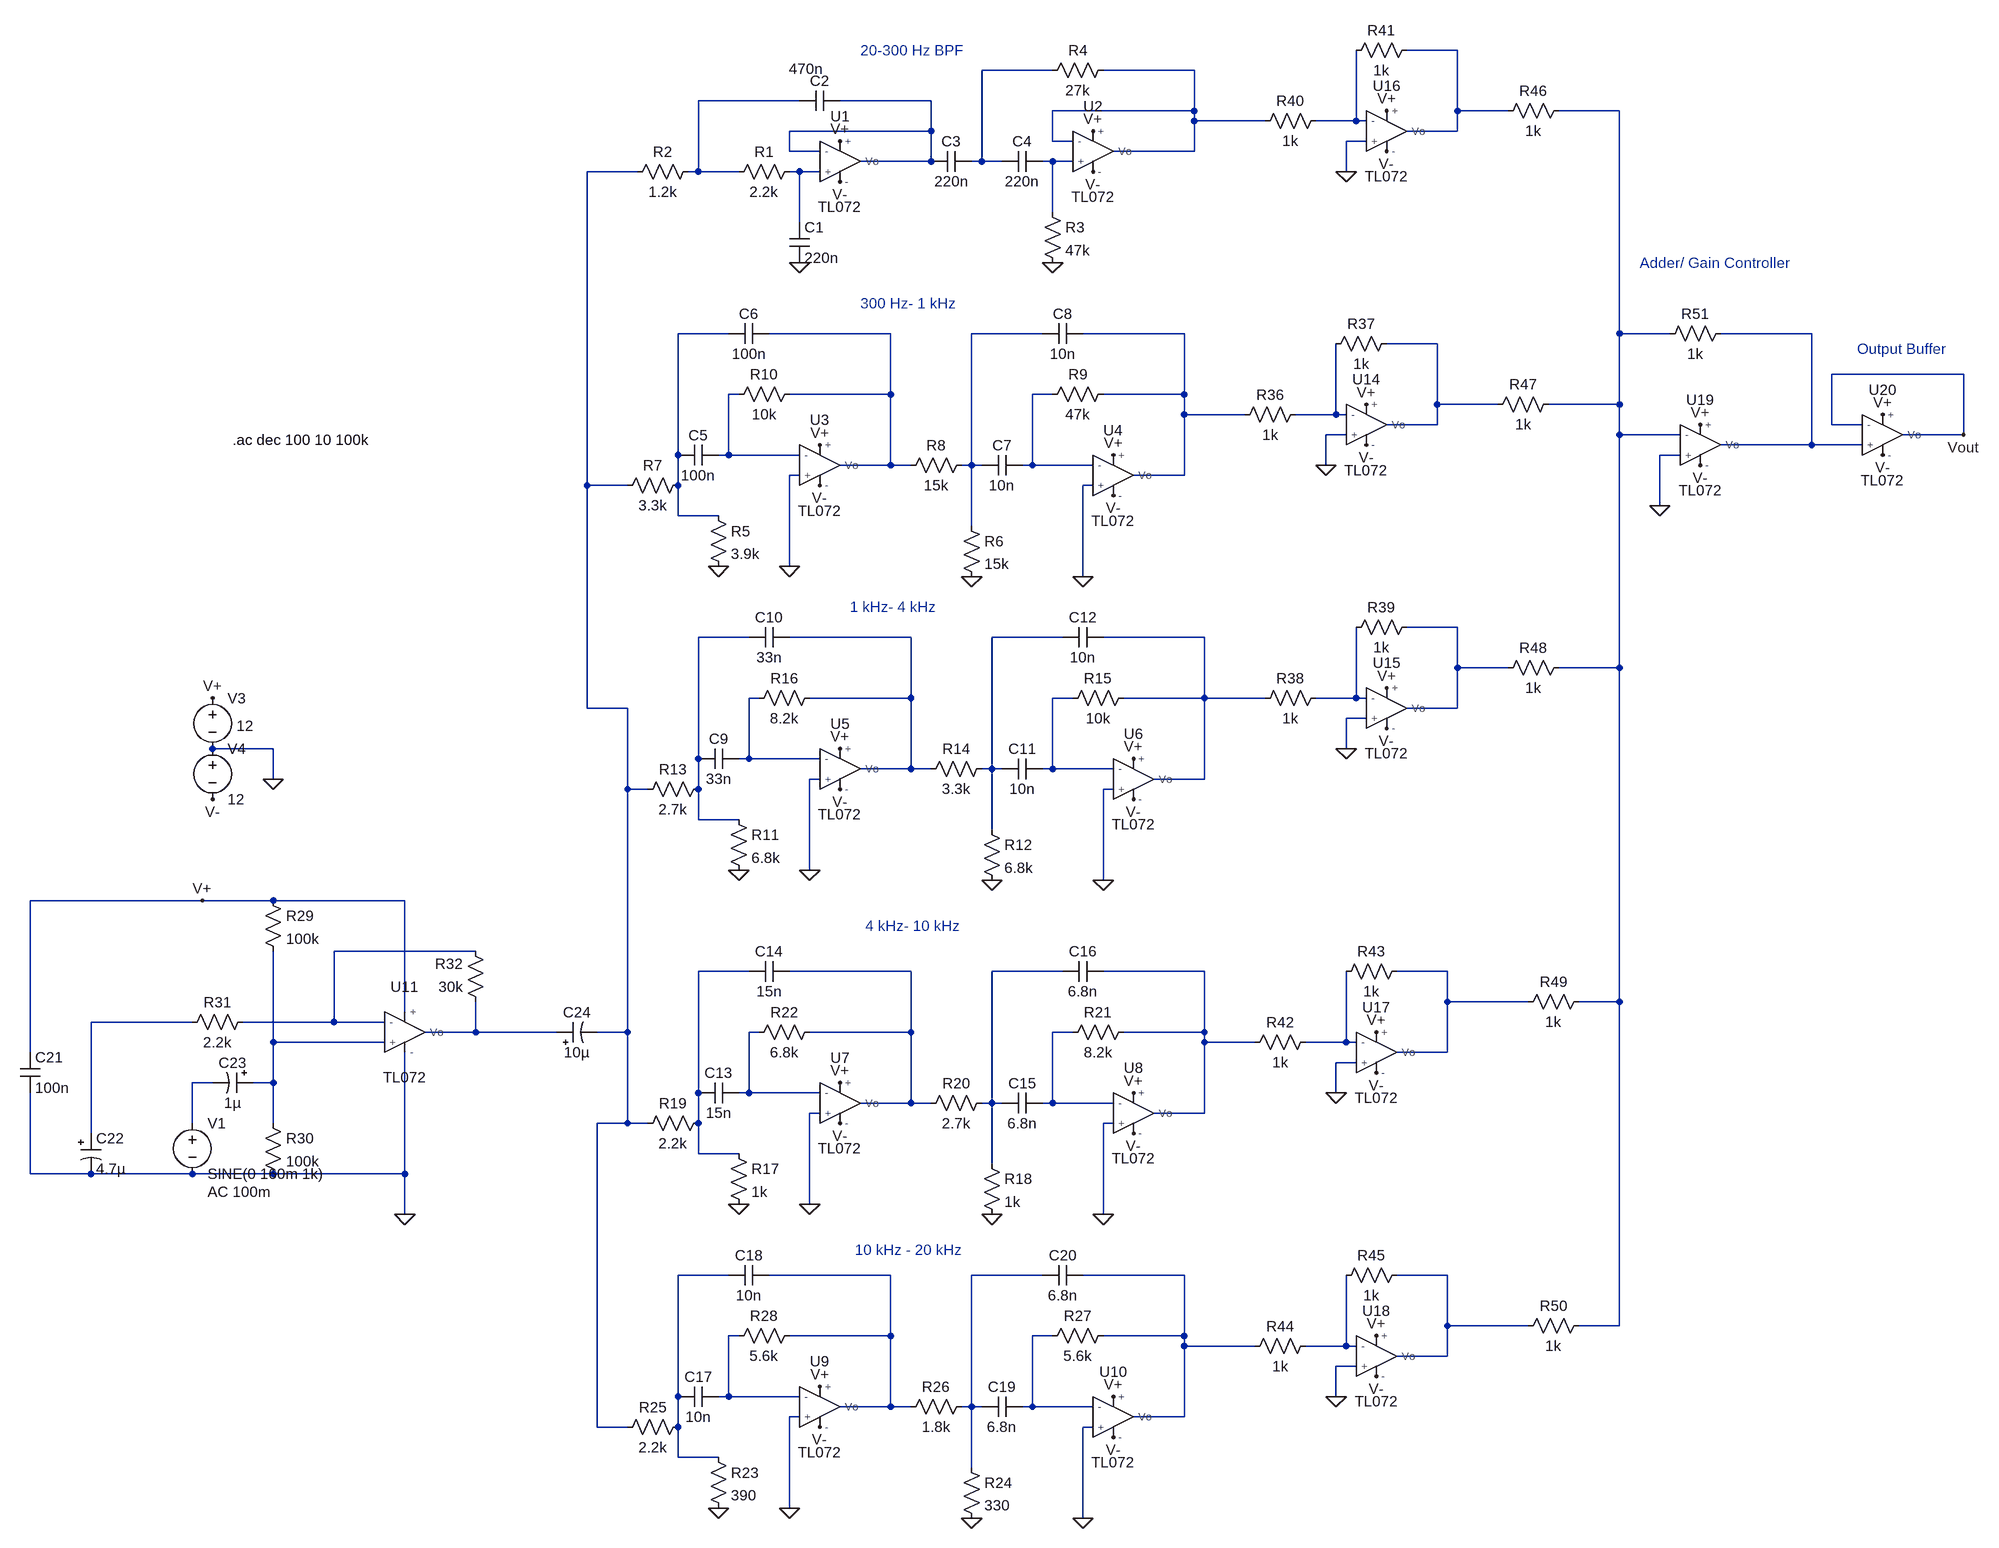
[diagram p0: schematic full.asc]
full.asc, the LTspice schematic file:
Version 4.1
SHEET 1 1868 2308
WIRE 1024 -32 944 -32
WIRE 384 0 272 0
WIRE 608 0 464 0
WIRE -16 48 -176 48
WIRE 192 48 48 48
WIRE 608 64 608 0
WIRE 608 64 384 64
WIRE 1024 64 1024 -32
WIRE 1104 64 1024 64
WIRE 1280 64 1184 64
WIRE 608 80 608 64
WIRE 720 80 608 80
WIRE 864 80 864 -32
WIRE 864 80 800 80
WIRE 880 80 864 80
WIRE 192 96 192 48
WIRE 192 96 -32 96
WIRE 1024 96 1024 64
WIRE 1024 96 944 96
WIRE 384 112 384 64
WIRE 416 112 384 112
WIRE 880 112 848 112
WIRE -32 128 -32 96
WIRE 16 128 -32 128
WIRE 608 128 608 80
WIRE 608 128 480 128
WIRE 192 144 192 96
WIRE 192 144 80 144
WIRE 272 144 272 0
WIRE 272 144 256 144
WIRE 304 144 272 144
WIRE 384 144 368 144
WIRE 416 144 384 144
WIRE -272 160 -352 160
WIRE -176 160 -176 48
WIRE -176 160 -192 160
WIRE -112 160 -176 160
WIRE -16 160 -32 160
WIRE 16 160 -16 160
WIRE 848 160 848 112
WIRE 384 224 384 144
WIRE -16 240 -16 160
WIRE -128 416 -208 416
WIRE 128 416 -64 416
WIRE 368 416 256 416
WIRE 592 416 432 416
WIRE 1280 416 1280 64
WIRE 1360 416 1280 416
WIRE 1584 416 1440 416
WIRE 992 432 912 432
WIRE 1824 480 1616 480
WIRE -112 512 -128 512
WIRE 128 512 128 416
WIRE 128 512 -32 512
WIRE 384 512 352 512
WIRE 592 512 592 416
WIRE 592 512 464 512
WIRE 992 528 992 432
WIRE 1088 528 992 528
WIRE 1280 528 1280 416
WIRE 1280 528 1168 528
WIRE 592 544 592 512
WIRE 688 544 592 544
WIRE 832 544 832 432
WIRE 832 544 768 544
WIRE 848 544 832 544
WIRE 992 560 992 528
WIRE 992 560 912 560
WIRE 1616 560 1616 480
WIRE 1664 560 1616 560
WIRE 848 576 816 576
WIRE 1280 576 1280 528
WIRE 1376 576 1280 576
WIRE 1824 576 1824 480
WIRE 1824 576 1728 576
WIRE 1584 592 1584 416
WIRE 1584 592 1440 592
WIRE 1664 592 1584 592
WIRE -208 608 -208 416
WIRE -128 608 -128 512
WIRE -128 608 -144 608
WIRE -16 608 -128 608
WIRE 1376 608 1344 608
WIRE 128 624 128 512
WIRE 128 624 48 624
WIRE 160 624 128 624
WIRE 256 624 256 416
WIRE 256 624 240 624
WIRE 272 624 256 624
WIRE 352 624 352 512
WIRE 352 624 336 624
WIRE 448 624 352 624
WIRE 816 624 816 576
WIRE -16 640 -32 640
WIRE 592 640 592 544
WIRE 592 640 512 640
WIRE -352 656 -352 160
WIRE -288 656 -352 656
WIRE -208 656 -208 608
WIRE 448 656 432 656
WIRE 1344 688 1344 608
WIRE -208 704 -208 656
WIRE -144 704 -208 704
WIRE 256 720 256 624
WIRE -32 784 -32 640
WIRE 432 800 432 656
WIRE 1024 880 944 880
WIRE -96 896 -176 896
WIRE 160 896 -32 896
WIRE 400 896 288 896
WIRE 624 896 464 896
WIRE 1024 944 1024 880
WIRE 1104 944 1024 944
WIRE 1280 944 1280 576
WIRE 1280 944 1184 944
WIRE -80 992 -96 992
WIRE 160 992 160 896
WIRE 160 992 0 992
WIRE 416 992 384 992
WIRE 624 992 624 896
WIRE 624 992 496 992
WIRE 720 992 624 992
WIRE 864 992 864 880
WIRE 864 992 800 992
WIRE 880 992 864 992
WIRE -352 1008 -352 656
WIRE -288 1008 -352 1008
WIRE 1024 1008 1024 944
WIRE 1024 1008 944 1008
WIRE 880 1024 848 1024
WIRE -848 1072 -944 1072
WIRE 848 1072 848 1024
WIRE -176 1088 -176 896
WIRE -96 1088 -96 992
WIRE -96 1088 -112 1088
WIRE 16 1088 -96 1088
WIRE 160 1104 160 992
WIRE 160 1104 80 1104
WIRE 192 1104 160 1104
WIRE 288 1104 288 896
WIRE 288 1104 272 1104
WIRE 304 1104 288 1104
WIRE 384 1104 384 992
WIRE 384 1104 368 1104
WIRE 480 1104 384 1104
WIRE -848 1120 -848 1072
WIRE 16 1120 0 1120
WIRE 624 1120 624 992
WIRE 624 1120 544 1120
WIRE -288 1136 -288 1008
WIRE -256 1136 -288 1136
WIRE -176 1136 -176 1088
WIRE 480 1136 464 1136
WIRE -176 1184 -176 1136
WIRE -112 1184 -176 1184
WIRE 288 1200 288 1104
WIRE 0 1264 0 1120
WIRE 464 1280 464 1136
WIRE -960 1312 -1232 1312
WIRE -848 1312 -960 1312
WIRE -640 1312 -848 1312
WIRE -528 1392 -752 1392
WIRE -96 1424 -176 1424
WIRE 160 1424 -32 1424
WIRE 400 1424 288 1424
WIRE 624 1424 464 1424
WIRE 1008 1424 928 1424
WIRE 1008 1472 1008 1424
WIRE 1136 1472 1008 1472
WIRE 1280 1472 1280 944
WIRE 1280 1472 1216 1472
WIRE -640 1488 -640 1312
WIRE -976 1504 -1136 1504
WIRE -752 1504 -752 1392
WIRE -752 1504 -896 1504
WIRE -672 1504 -752 1504
WIRE -528 1520 -528 1472
WIRE -528 1520 -608 1520
WIRE -400 1520 -528 1520
WIRE -288 1520 -288 1136
WIRE -288 1520 -336 1520
WIRE -80 1520 -96 1520
WIRE 160 1520 160 1424
WIRE 160 1520 0 1520
WIRE 416 1520 384 1520
WIRE 624 1520 624 1424
WIRE 624 1520 496 1520
WIRE -848 1536 -848 1392
WIRE -672 1536 -848 1536
WIRE 624 1536 624 1520
WIRE 704 1536 624 1536
WIRE 848 1536 848 1424
WIRE 848 1536 784 1536
WIRE 864 1536 848 1536
WIRE -1232 1552 -1232 1312
WIRE 1008 1552 1008 1472
WIRE 1008 1552 928 1552
WIRE 864 1568 832 1568
WIRE -944 1600 -976 1600
WIRE -848 1600 -848 1536
WIRE -848 1600 -880 1600
WIRE -176 1616 -176 1424
WIRE -96 1616 -96 1520
WIRE -96 1616 -112 1616
WIRE 16 1616 -96 1616
WIRE 832 1616 832 1568
WIRE 160 1632 160 1520
WIRE 160 1632 80 1632
WIRE 192 1632 160 1632
WIRE 288 1632 288 1424
WIRE 288 1632 272 1632
WIRE 304 1632 288 1632
WIRE 384 1632 384 1520
WIRE 384 1632 368 1632
WIRE 480 1632 384 1632
WIRE 16 1648 0 1648
WIRE 624 1648 624 1536
WIRE 624 1648 544 1648
WIRE -976 1664 -976 1600
WIRE -848 1664 -848 1600
WIRE -288 1664 -288 1520
WIRE -288 1664 -336 1664
WIRE -256 1664 -288 1664
WIRE -176 1664 -176 1616
WIRE 480 1664 464 1664
WIRE -1136 1680 -1136 1504
WIRE -176 1712 -176 1664
WIRE -112 1712 -176 1712
WIRE 288 1728 288 1632
WIRE -1232 1744 -1232 1616
WIRE -1136 1744 -1232 1744
WIRE -976 1744 -1136 1744
WIRE -848 1744 -976 1744
WIRE -640 1744 -640 1552
WIRE -640 1744 -848 1744
WIRE 0 1792 0 1648
WIRE -640 1808 -640 1744
WIRE 464 1808 464 1664
WIRE -128 1904 -208 1904
WIRE 128 1904 -64 1904
WIRE 368 1904 256 1904
WIRE 592 1904 432 1904
WIRE 1008 1904 928 1904
WIRE 1008 1984 1008 1904
WIRE 1136 1984 1008 1984
WIRE 1280 1984 1280 1472
WIRE 1280 1984 1216 1984
WIRE -112 2000 -128 2000
WIRE 128 2000 128 1904
WIRE 128 2000 -32 2000
WIRE 384 2000 352 2000
WIRE 592 2000 592 1904
WIRE 592 2000 464 2000
WIRE 592 2016 592 2000
WIRE 704 2016 592 2016
WIRE 848 2016 848 1904
WIRE 848 2016 784 2016
WIRE 864 2016 848 2016
WIRE 1008 2032 1008 1984
WIRE 1008 2032 928 2032
WIRE 864 2048 832 2048
WIRE -208 2096 -208 1904
WIRE -128 2096 -128 2000
WIRE -128 2096 -144 2096
WIRE -16 2096 -128 2096
WIRE 832 2096 832 2048
WIRE 128 2112 128 2000
WIRE 128 2112 48 2112
WIRE 160 2112 128 2112
WIRE 256 2112 256 1904
WIRE 256 2112 240 2112
WIRE 272 2112 256 2112
WIRE 352 2112 352 2000
WIRE 352 2112 336 2112
WIRE 448 2112 352 2112
WIRE -16 2128 -32 2128
WIRE 592 2128 592 2016
WIRE 592 2128 512 2128
WIRE -336 2144 -336 1664
WIRE -288 2144 -336 2144
WIRE -208 2144 -208 2096
WIRE 448 2144 432 2144
WIRE -208 2192 -208 2144
WIRE -144 2192 -208 2192
WIRE 256 2208 256 2112
WIRE -32 2272 -32 2128
WIRE 432 2288 432 2144
FLAG -16 304 0
FLAG 384 304 0
FLAG 48 112 V+
FLAG 448 96 V+
FLAG 48 176 V-
FLAG 448 160 V-
FLAG -144 784 0
FLAG 256 800 0
FLAG 432 800 0
FLAG -32 784 0
FLAG 480 608 V+
FLAG 16 592 V+
FLAG 16 656 V-
FLAG 480 672 V-
FLAG -112 1264 0
FLAG 288 1280 0
FLAG 464 1280 0
FLAG 0 1264 0
FLAG -848 1120 0
FLAG 512 1088 V+
FLAG 48 1072 V+
FLAG -944 992 V+
FLAG -944 1152 V-
FLAG 48 1136 V-
FLAG 512 1152 V-
FLAG -112 1792 0
FLAG 288 1808 0
FLAG 464 1808 0
FLAG 0 1792 0
FLAG 512 1616 V+
FLAG 48 1600 V+
FLAG 48 1664 V-
FLAG 512 1680 V-
FLAG -144 2272 0
FLAG 256 2288 0
FLAG 432 2288 0
FLAG -32 2272 0
FLAG 480 2096 V+
FLAG 16 2080 V+
FLAG 16 2144 V-
FLAG 480 2160 V-
FLAG 816 624 0
FLAG 880 592 V-
FLAG 880 528 V+
FLAG 848 1072 0
FLAG 912 1040 V-
FLAG 912 976 V+
FLAG 848 160 0
FLAG 912 128 V-
FLAG 912 64 V+
FLAG 832 1616 0
FLAG 896 1584 V-
FLAG 896 1520 V+
FLAG 832 2096 0
FLAG 896 2064 V-
FLAG 896 2000 V+
FLAG 1408 624 V-
FLAG 1408 560 V+
FLAG 1344 688 0
FLAG 1696 608 V-
FLAG 1696 544 V+
FLAG 1824 576 Vout
FLAG -640 1808 0
FLAG -960 1312 V+
SYMBOL TL072 48 144 R0
SYMATTR InstName U1
SYMBOL TL072 448 128 R0
SYMATTR InstName U2
SYMBOL res -16 144 R90
WINDOW 0 0 56 VBottom 2
WINDOW 3 32 56 VTop 2
SYMATTR InstName R1
SYMATTR Value 2.2k
SYMBOL res -176 144 R90
WINDOW 0 0 56 VBottom 2
WINDOW 3 32 56 VTop 2
SYMATTR InstName R2
SYMATTR Value 1.2k
SYMBOL cap -32 240 R0
SYMATTR InstName C1
SYMATTR Value 220n
SYMBOL cap 48 32 R90
WINDOW 0 0 32 VBottom 2
WINDOW 3 -50 54 VTop 2
SYMATTR InstName C2
SYMATTR Value 470n
SYMBOL cap 256 128 R90
WINDOW 0 0 32 VBottom 2
WINDOW 3 32 32 VTop 2
SYMATTR InstName C3
SYMATTR Value 220n
SYMBOL cap 368 128 R90
WINDOW 0 0 32 VBottom 2
WINDOW 3 32 32 VTop 2
SYMATTR InstName C4
SYMATTR Value 220n
SYMBOL res 368 208 R0
SYMATTR InstName R3
SYMATTR Value 47k
SYMBOL res 480 -16 R90
WINDOW 0 0 56 VBottom 2
WINDOW 3 32 56 VTop 2
SYMATTR InstName R4
SYMATTR Value 27k
SYMBOL res -160 688 R0
SYMATTR InstName R5
SYMATTR Value 3.9k
SYMBOL res 240 704 R0
SYMATTR InstName R6
SYMATTR Value 15k
SYMBOL res -192 640 R90
WINDOW 0 0 56 VBottom 2
WINDOW 3 32 56 VTop 2
SYMATTR InstName R7
SYMATTR Value 3.3k
SYMBOL res 256 608 R90
WINDOW 0 0 56 VBottom 2
WINDOW 3 32 56 VTop 2
SYMATTR InstName R8
SYMATTR Value 15k
SYMBOL res 480 496 R90
WINDOW 0 0 56 VBottom 2
WINDOW 3 32 56 VTop 2
SYMATTR InstName R9
SYMATTR Value 47k
SYMBOL res -16 496 R90
WINDOW 0 0 56 VBottom 2
WINDOW 3 32 56 VTop 2
SYMATTR InstName R10
SYMATTR Value 10k
SYMBOL cap -144 592 R90
WINDOW 0 0 32 VBottom 2
WINDOW 3 32 32 VTop 2
SYMATTR InstName C5
SYMATTR Value 100n
SYMBOL cap -64 400 R90
WINDOW 0 0 32 VBottom 2
WINDOW 3 32 32 VTop 2
SYMATTR InstName C6
SYMATTR Value 100n
SYMBOL cap 336 608 R90
WINDOW 0 0 32 VBottom 2
WINDOW 3 32 32 VTop 2
SYMATTR InstName C7
SYMATTR Value 10n
SYMBOL cap 432 400 R90
WINDOW 0 0 32 VBottom 2
WINDOW 3 32 32 VTop 2
SYMATTR InstName C8
SYMATTR Value 10n
SYMBOL TL072 16 624 R0
SYMATTR InstName U3
SYMBOL TL072 480 640 R0
SYMATTR InstName U4
SYMBOL res -128 1168 R0
SYMATTR InstName R11
SYMATTR Value 6.8k
SYMBOL res 272 1184 R0
SYMATTR InstName R12
SYMATTR Value 6.8k
SYMBOL res -160 1120 R90
WINDOW 0 0 56 VBottom 2
WINDOW 3 32 56 VTop 2
SYMATTR InstName R13
SYMATTR Value 2.7k
SYMBOL res 288 1088 R90
WINDOW 0 0 56 VBottom 2
WINDOW 3 32 56 VTop 2
SYMATTR InstName R14
SYMATTR Value 3.3k
SYMBOL res 512 976 R90
WINDOW 0 0 56 VBottom 2
WINDOW 3 32 56 VTop 2
SYMATTR InstName R15
SYMATTR Value 10k
SYMBOL res 16 976 R90
WINDOW 0 0 56 VBottom 2
WINDOW 3 32 56 VTop 2
SYMATTR InstName R16
SYMATTR Value 8.2k
SYMBOL cap -112 1072 R90
WINDOW 0 0 32 VBottom 2
WINDOW 3 32 32 VTop 2
SYMATTR InstName C9
SYMATTR Value 33n
SYMBOL cap -32 880 R90
WINDOW 0 0 32 VBottom 2
WINDOW 3 32 32 VTop 2
SYMATTR InstName C10
SYMATTR Value 33n
SYMBOL cap 368 1088 R90
WINDOW 0 0 32 VBottom 2
WINDOW 3 32 32 VTop 2
SYMATTR InstName C11
SYMATTR Value 10n
SYMBOL cap 464 880 R90
WINDOW 0 0 32 VBottom 2
WINDOW 3 32 32 VTop 2
SYMATTR InstName C12
SYMATTR Value 10n
SYMBOL voltage -944 976 R0
WINDOW 3 38 60 Left 2
WINDOW 123 0 0 Left 0
WINDOW 39 0 0 Left 0
SYMATTR Value 12
SYMATTR InstName V3
SYMBOL voltage -944 1056 R0
WINDOW 123 0 0 Left 0
WINDOW 39 0 0 Left 0
SYMATTR InstName V4
SYMATTR Value 12
SYMBOL TL072 48 1104 R0
SYMATTR InstName U5
SYMBOL TL072 512 1120 R0
SYMATTR InstName U6
SYMBOL res -128 1696 R0
SYMATTR InstName R17
SYMATTR Value 1k
SYMBOL res 272 1712 R0
SYMATTR InstName R18
SYMATTR Value 1k
SYMBOL res -160 1648 R90
WINDOW 0 0 56 VBottom 2
WINDOW 3 32 56 VTop 2
SYMATTR InstName R19
SYMATTR Value 2.2k
SYMBOL res 288 1616 R90
WINDOW 0 0 56 VBottom 2
WINDOW 3 32 56 VTop 2
SYMATTR InstName R20
SYMATTR Value 2.7k
SYMBOL res 512 1504 R90
WINDOW 0 0 56 VBottom 2
WINDOW 3 32 56 VTop 2
SYMATTR InstName R21
SYMATTR Value 8.2k
SYMBOL res 16 1504 R90
WINDOW 0 0 56 VBottom 2
WINDOW 3 32 56 VTop 2
SYMATTR InstName R22
SYMATTR Value 6.8k
SYMBOL cap -112 1600 R90
WINDOW 0 0 32 VBottom 2
WINDOW 3 32 32 VTop 2
SYMATTR InstName C13
SYMATTR Value 15n
SYMBOL cap -32 1408 R90
WINDOW 0 0 32 VBottom 2
WINDOW 3 32 32 VTop 2
SYMATTR InstName C14
SYMATTR Value 15n
SYMBOL cap 368 1616 R90
WINDOW 0 0 32 VBottom 2
WINDOW 3 32 32 VTop 2
SYMATTR InstName C15
SYMATTR Value 6.8n
SYMBOL cap 464 1408 R90
WINDOW 0 0 32 VBottom 2
WINDOW 3 32 32 VTop 2
SYMATTR InstName C16
SYMATTR Value 6.8n
SYMBOL TL072 48 1632 R0
SYMATTR InstName U7
SYMBOL TL072 512 1648 R0
SYMATTR InstName U8
SYMBOL res -160 2176 R0
SYMATTR InstName R23
SYMATTR Value 390
SYMBOL res 240 2192 R0
SYMATTR InstName R24
SYMATTR Value 330
SYMBOL res -192 2128 R90
WINDOW 0 0 56 VBottom 2
WINDOW 3 32 56 VTop 2
SYMATTR InstName R25
SYMATTR Value 2.2k
SYMBOL res 256 2096 R90
WINDOW 0 0 56 VBottom 2
WINDOW 3 32 56 VTop 2
SYMATTR InstName R26
SYMATTR Value 1.8k
SYMBOL res 480 1984 R90
WINDOW 0 0 56 VBottom 2
WINDOW 3 32 56 VTop 2
SYMATTR InstName R27
SYMATTR Value 5.6k
SYMBOL res -16 1984 R90
WINDOW 0 0 56 VBottom 2
WINDOW 3 32 56 VTop 2
SYMATTR InstName R28
SYMATTR Value 5.6k
SYMBOL cap -144 2080 R90
WINDOW 0 0 32 VBottom 2
WINDOW 3 32 32 VTop 2
SYMATTR InstName C17
SYMATTR Value 10n
SYMBOL cap -64 1888 R90
WINDOW 0 0 32 VBottom 2
WINDOW 3 32 32 VTop 2
SYMATTR InstName C18
SYMATTR Value 10n
SYMBOL cap 336 2096 R90
WINDOW 0 0 32 VBottom 2
WINDOW 3 32 32 VTop 2
SYMATTR InstName C19
SYMATTR Value 6.8n
SYMBOL cap 432 1888 R90
WINDOW 0 0 32 VBottom 2
WINDOW 3 32 32 VTop 2
SYMATTR InstName C20
SYMATTR Value 6.8n
SYMBOL TL072 16 2112 R0
SYMATTR InstName U9
SYMBOL TL072 480 2128 R0
SYMATTR InstName U10
SYMBOL TL072 880 560 R0
SYMATTR InstName U14
SYMBOL res 784 528 R90
WINDOW 0 0 56 VBottom 2
WINDOW 3 32 56 VTop 2
SYMATTR InstName R36
SYMATTR Value 1k
SYMBOL res 928 416 R90
WINDOW 0 0 56 VBottom 2
WINDOW 3 32 56 VTop 2
SYMATTR InstName R37
SYMATTR Value 1k
SYMBOL TL072 912 1008 R0
SYMATTR InstName U15
SYMBOL res 816 976 R90
WINDOW 0 0 56 VBottom 2
WINDOW 3 32 56 VTop 2
SYMATTR InstName R38
SYMATTR Value 1k
SYMBOL res 960 864 R90
WINDOW 0 0 56 VBottom 2
WINDOW 3 32 56 VTop 2
SYMATTR InstName R39
SYMATTR Value 1k
SYMBOL TL072 912 96 R0
SYMATTR InstName U16
SYMBOL res 816 64 R90
WINDOW 0 0 56 VBottom 2
WINDOW 3 32 56 VTop 2
SYMATTR InstName R40
SYMATTR Value 1k
SYMBOL res 960 -48 R90
WINDOW 0 0 56 VBottom 2
WINDOW 3 32 56 VTop 2
SYMATTR InstName R41
SYMATTR Value 1k
SYMBOL TL072 896 1552 R0
SYMATTR InstName U17
SYMBOL res 800 1520 R90
WINDOW 0 0 56 VBottom 2
WINDOW 3 32 56 VTop 2
SYMATTR InstName R42
SYMATTR Value 1k
SYMBOL res 944 1408 R90
WINDOW 0 0 56 VBottom 2
WINDOW 3 32 56 VTop 2
SYMATTR InstName R43
SYMATTR Value 1k
SYMBOL TL072 896 2032 R0
SYMATTR InstName U18
SYMBOL res 800 2000 R90
WINDOW 0 0 56 VBottom 2
WINDOW 3 32 56 VTop 2
SYMATTR InstName R44
SYMATTR Value 1k
SYMBOL res 944 1888 R90
WINDOW 0 0 56 VBottom 2
WINDOW 3 32 56 VTop 2
SYMATTR InstName R45
SYMATTR Value 1k
SYMBOL TL072 1408 592 R0
SYMATTR InstName U19
SYMBOL res 1200 48 R90
WINDOW 0 0 56 VBottom 2
WINDOW 3 32 56 VTop 2
SYMATTR InstName R46
SYMATTR Value 1k
SYMBOL res 1184 512 R90
WINDOW 0 0 56 VBottom 2
WINDOW 3 32 56 VTop 2
SYMATTR InstName R47
SYMATTR Value 1k
SYMBOL res 1200 928 R90
WINDOW 0 0 56 VBottom 2
WINDOW 3 32 56 VTop 2
SYMATTR InstName R48
SYMATTR Value 1k
SYMBOL res 1232 1456 R90
WINDOW 0 0 56 VBottom 2
WINDOW 3 32 56 VTop 2
SYMATTR InstName R49
SYMATTR Value 1k
SYMBOL res 1232 1968 R90
WINDOW 0 0 56 VBottom 2
WINDOW 3 32 56 VTop 2
SYMATTR InstName R50
SYMATTR Value 1k
SYMBOL res 1456 400 R90
WINDOW 0 0 56 VBottom 2
WINDOW 3 32 56 VTop 2
SYMATTR InstName R51
SYMATTR Value 1k
SYMBOL TL072 1696 576 R0
SYMATTR InstName U20
SYMBOL TL072 -640 1520 R0
SYMATTR InstName U11
SYMBOL res -864 1296 R0
SYMATTR InstName R29
SYMATTR Value 100k
SYMBOL res -864 1648 R0
SYMATTR InstName R30
SYMATTR Value 100k
SYMBOL res -880 1488 R90
WINDOW 0 0 56 VBottom 2
WINDOW 3 32 56 VTop 2
SYMATTR InstName R31
SYMATTR Value 2.2k
SYMBOL res -512 1488 R180
WINDOW 0 36 76 Left 2
WINDOW 3 36 40 Left 2
SYMATTR InstName R32
SYMATTR Value 30k
SYMBOL cap -1248 1552 R0
SYMATTR InstName C21
SYMATTR Value 100n
SYMBOL polcap -1152 1680 R0
SYMATTR InstName C22
SYMATTR Value 4.7µ
SYMBOL polcap -880 1584 R90
WINDOW 0 0 32 VBottom 2
WINDOW 3 32 32 VTop 2
SYMATTR InstName C23
SYMATTR Value 1µ
SYMBOL polcap -400 1536 R270
WINDOW 0 32 32 VTop 2
WINDOW 3 0 32 VBottom 2
SYMATTR InstName C24
SYMATTR Value 10µ
SYMBOL voltage -976 1648 R0
WINDOW 123 24 124 Left 2
WINDOW 39 0 0 Left 0
SYMATTR Value2 AC 100m
SYMATTR InstName V1
SYMATTR Value SINE(0 160m 1k)
TEXT -912 584 Left 2 !.ac dec 100 10 100k
TEXT 80 -32 Left 2 ;20-300 Hz BPF
TEXT 80 368 Left 2 ;300 Hz- 1 kHz
TEXT 64 848 Left 2 ;1 kHz- 4 kHz
TEXT 88 1352 Left 2 ;4 kHz- 10 kHz
TEXT 72 1864 Left 2 ;10 kHz - 20 kHz
TEXT 1312 304 Left 2 ;Adder/ Gain Controller
TEXT 1656 440 Left 2 ;Output Buffer

The netlist it stands for:
* full.asc
X§U1 N010 N005 V+ V- N005 TL072  ; pins + - + - Vo
X§U2 N008 N003 V+ V- N003 TL072  ; pins + - + - Vo
R1 N010 N004 2.2k
R2 N004 N009 1.2k
C1 N010 0 220n
C2 N005 N004 470n
C3 N002 N005 220n
C4 N008 N002 220n
R3 N008 0 47k
R4 N003 N002 27k
R5 N011 0 3.9k
R6 N013 0 15k
R7 N011 N009 3.3k
R8 N013 N012 15k
R9 N014 N018 47k
R10 N012 N017 10k
C5 N017 N011 100n
C6 N012 N011 100n
C7 N018 N013 10n
C8 N014 N013 10n
X§U3 0 N017 V+ V- N012 TL072  ; pins + - + - Vo
X§U4 0 N018 V+ V- N014 TL072  ; pins + - + - Vo
R11 N021 0 6.8k
R12 N023 0 6.8k
R13 N021 N009 2.7k
R14 N023 N022 3.3k
R15 N024 N026 10k
R16 N022 N025 8.2k
C9 N025 N021 33n
C10 N022 N021 33n
C11 N026 N023 10n
C12 N024 N023 10n
V3 V+ 0 12
V4 0 V- 12
X§U5 0 N025 V+ V- N022 TL072  ; pins + - + - Vo
X§U6 0 N026 V+ V- N024 TL072  ; pins + - + - Vo
R17 N029 0 1k
R18 N031 0 1k
R19 N029 N009 2.2k
R20 N031 N030 2.7k
R21 N032 N037 8.2k
R22 N030 N036 6.8k
C13 N036 N029 15n
C14 N030 N029 15n
C15 N037 N031 6.8n
C16 N032 N031 6.8n
X§U7 0 N036 V+ V- N030 TL072  ; pins + - + - Vo
X§U8 0 N037 V+ V- N032 TL072  ; pins + - + - Vo
R23 N041 0 390
R24 N043 0 330
R25 N041 N009 2.2k
R26 N043 N042 1.8k
R27 N044 N047 5.6k
R28 N042 N046 5.6k
C17 N046 N041 10n
C18 N042 N041 10n
C19 N047 N043 6.8n
C20 N044 N043 6.8n
X§U9 0 N046 V+ V- N042 TL072  ; pins + - + - Vo
X§U10 0 N047 V+ V- N044 TL072  ; pins + - + - Vo
X§U14 0 N019 V+ V- N016 TL072  ; pins + - + - Vo
R36 N019 N014 1k
R37 N016 N019 1k
X§U15 0 N027 V+ V- N020 TL072  ; pins + - + - Vo
R38 N027 N024 1k
R39 N020 N027 1k
X§U16 0 N007 V+ V- N001 TL072  ; pins + - + - Vo
R40 N007 N003 1k
R41 N001 N007 1k
X§U17 0 N039 V+ V- N033 TL072  ; pins + - + - Vo
R42 N039 N032 1k
R43 N033 N039 1k
X§U18 0 N048 V+ V- N045 TL072  ; pins + - + - Vo
R44 N048 N044 1k
R45 N045 N048 1k
X§U19 0 N006 V+ V- N015 TL072  ; pins + - + - Vo
R46 N006 N001 1k
R47 N006 N016 1k
R48 N006 N020 1k
R49 N006 N033 1k
R50 N006 N045 1k
R51 N015 N006 1k
X§U20 N015 Vout V+ V- Vout TL072  ; pins + - + - Vo
X§U11 N038 N028 V+ 0 N035 TL072  ; pins + - + - Vo
R29 V+ N038 100k
R30 N038 0 100k
R31 N028 N034 2.2k
R32 N035 N028 30k
C21 V+ 0 100n
C22 N034 0 4.7µ
C23 N038 N040 1µ
C24 N035 N009 10µ
V1 N040 0 SINE(0 160m 1k) AC 100m
.ac dec 100 10 100k
* 20-300 Hz BPF
* 300 Hz- 1 kHz
* 1 kHz- 4 kHz
* 4 kHz- 10 kHz
* 10 kHz - 20 kHz
* Adder/ Gain Controller
* Output Buffer
.lib C:\Users\ASUS TUF X506H\AppData\Local\Microsoft\Windows\INetCache\IE\LMH602MS\TL072[2].txt
.backanno
.end